# Altium schematic sheet RS232 Transciever (MAX232).SchDoc
size A4
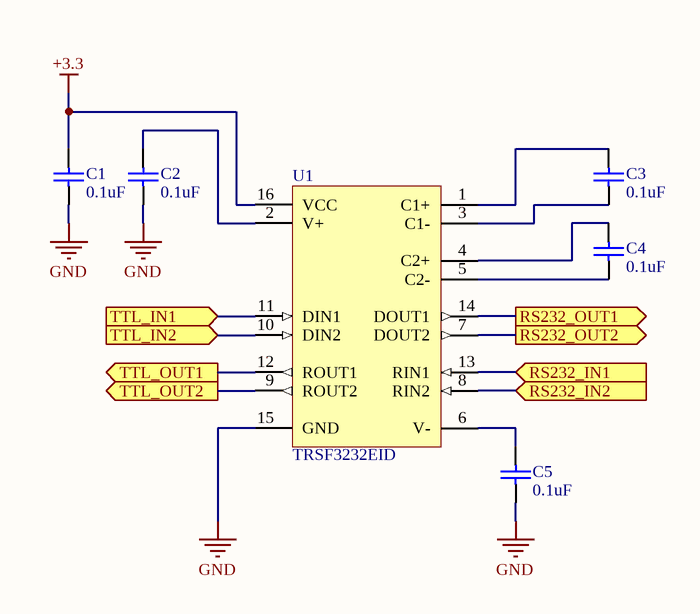
[diagram p0: RS232 Transciever (MAX232).SchDoc]

## Parts
C1  value 0.1uF  [C0603]  (hidden comment: Cap)
C2  value 0.1uF  [C0603]  (hidden comment: Cap)
C3  value 0.1uF  [C0603]  (hidden comment: Cap)
C4  value 0.1uF  [C0603]  (hidden comment: Cap)
C5  value 0.1uF  [C0603]  (hidden comment: Cap)
U1  TRSF3232EID  [SOIC127P600X175-16N]

## Ports
RS232_IN1 (in), RS232_IN2 (in), RS232_OUT1 (out), RS232_OUT2 (out), TTL_IN1 (in), TTL_IN2 (in), TTL_OUT1 (out), TTL_OUT2 (out)

## Nets
+3.3: C1.1 U1.16(VCC)
GND: C1.2 C2.2 C5.2 U1.15(GND)
RS232_IN1: U1.13(RIN1) ; port RS232_IN1
RS232_IN2: U1.8(RIN2) ; port RS232_IN2
RS232_OUT1: U1.14(DOUT1) ; port RS232_OUT1
RS232_OUT2: U1.7(DOUT2) ; port RS232_OUT2
TTL_IN1: U1.11(DIN1) ; port TTL_IN1
TTL_IN2: U1.10(DIN2) ; port TTL_IN2
TTL_OUT1: U1.12(ROUT1) ; port TTL_OUT1
TTL_OUT2: U1.9(ROUT2) ; port TTL_OUT2
NetC2_1: C2.1 U1.2(V+)
NetC3_1: C3.1 U1.1(C1+)
NetC3_2: C3.2 U1.3(C1-)
NetC4_1: C4.1 U1.4(C2+)
NetC4_2: C4.2 U1.5(C2-)
NetC5_1: C5.1 U1.6(V-)

## Library data of the parts
C1-C5 = Cap: Capacitor; farnell: 1759122
U1 = TRSF3232EID: TEXAS INSTRUMENTS - TRSF3232EID - RS232, 1MBIT, LINE DRIV/REC, 16SOIC; farnell: 1603424